# EAGLE schematic mp2489 (EAGLE 8.4.2)
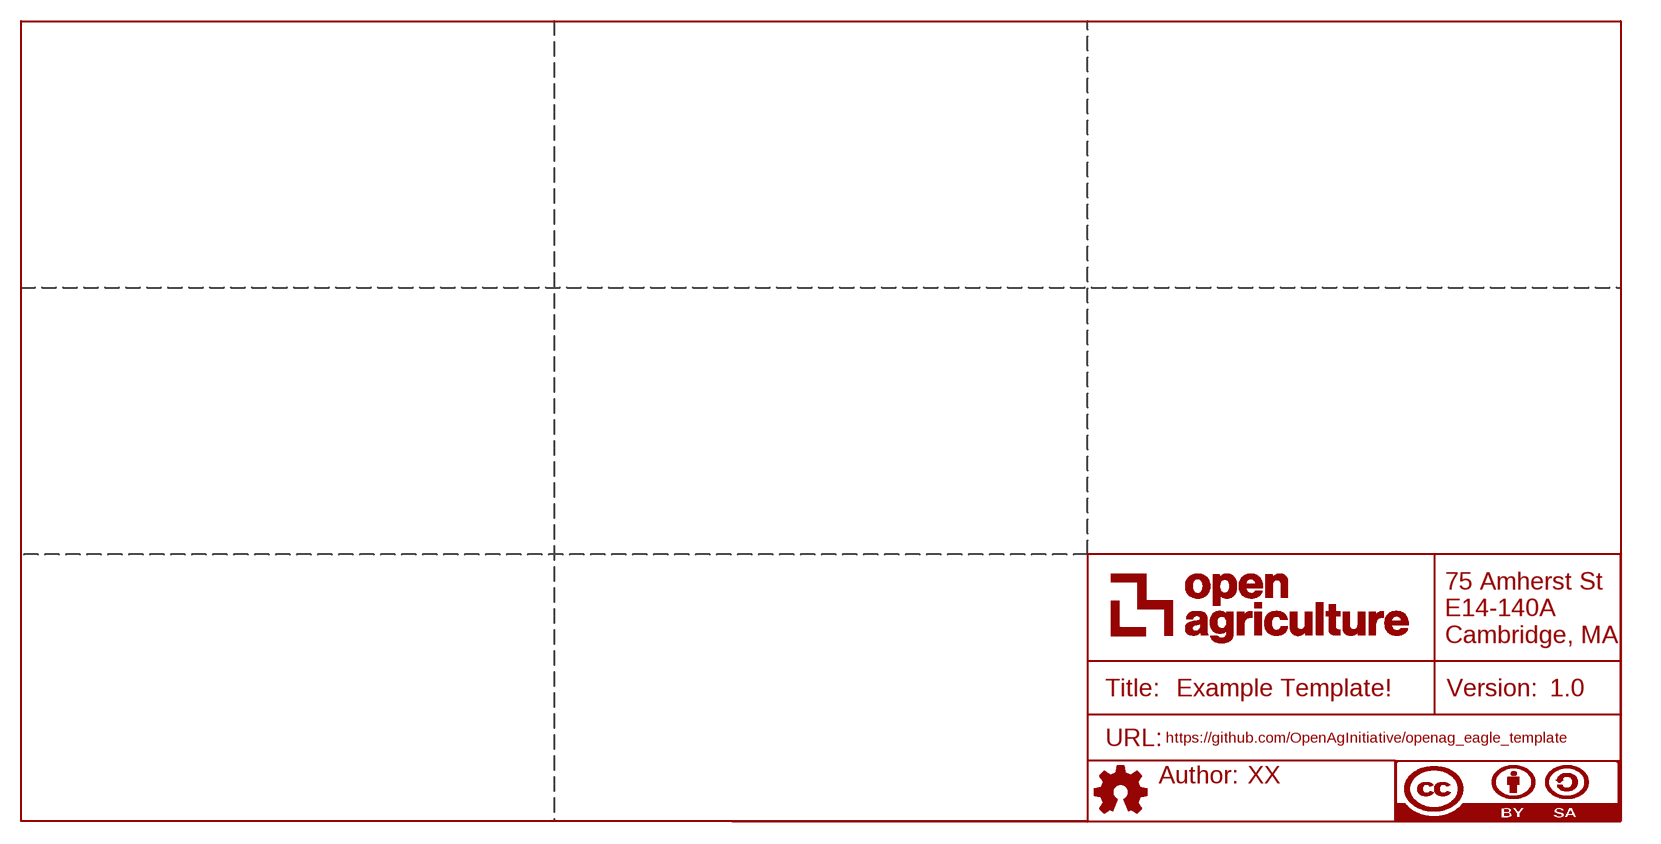
[diagram p0: schematic, sheet 1]

## Parts
FRAME1  DOCFIELD  [DOCFIELD]

## Library data of the parts
FRAME1 = openag-frames:DOCFIELD: DOCUMENT FIELD; AUTHOR: XX; DESCRIPTION: Template for starting new designs.; TITLE: Example Template!; URL: https://github.com/OpenAgInitiative/openag_eagle_template; VER: 1.0